# EAGLE design ice_tube_clock (EAGLE 7.3.0)
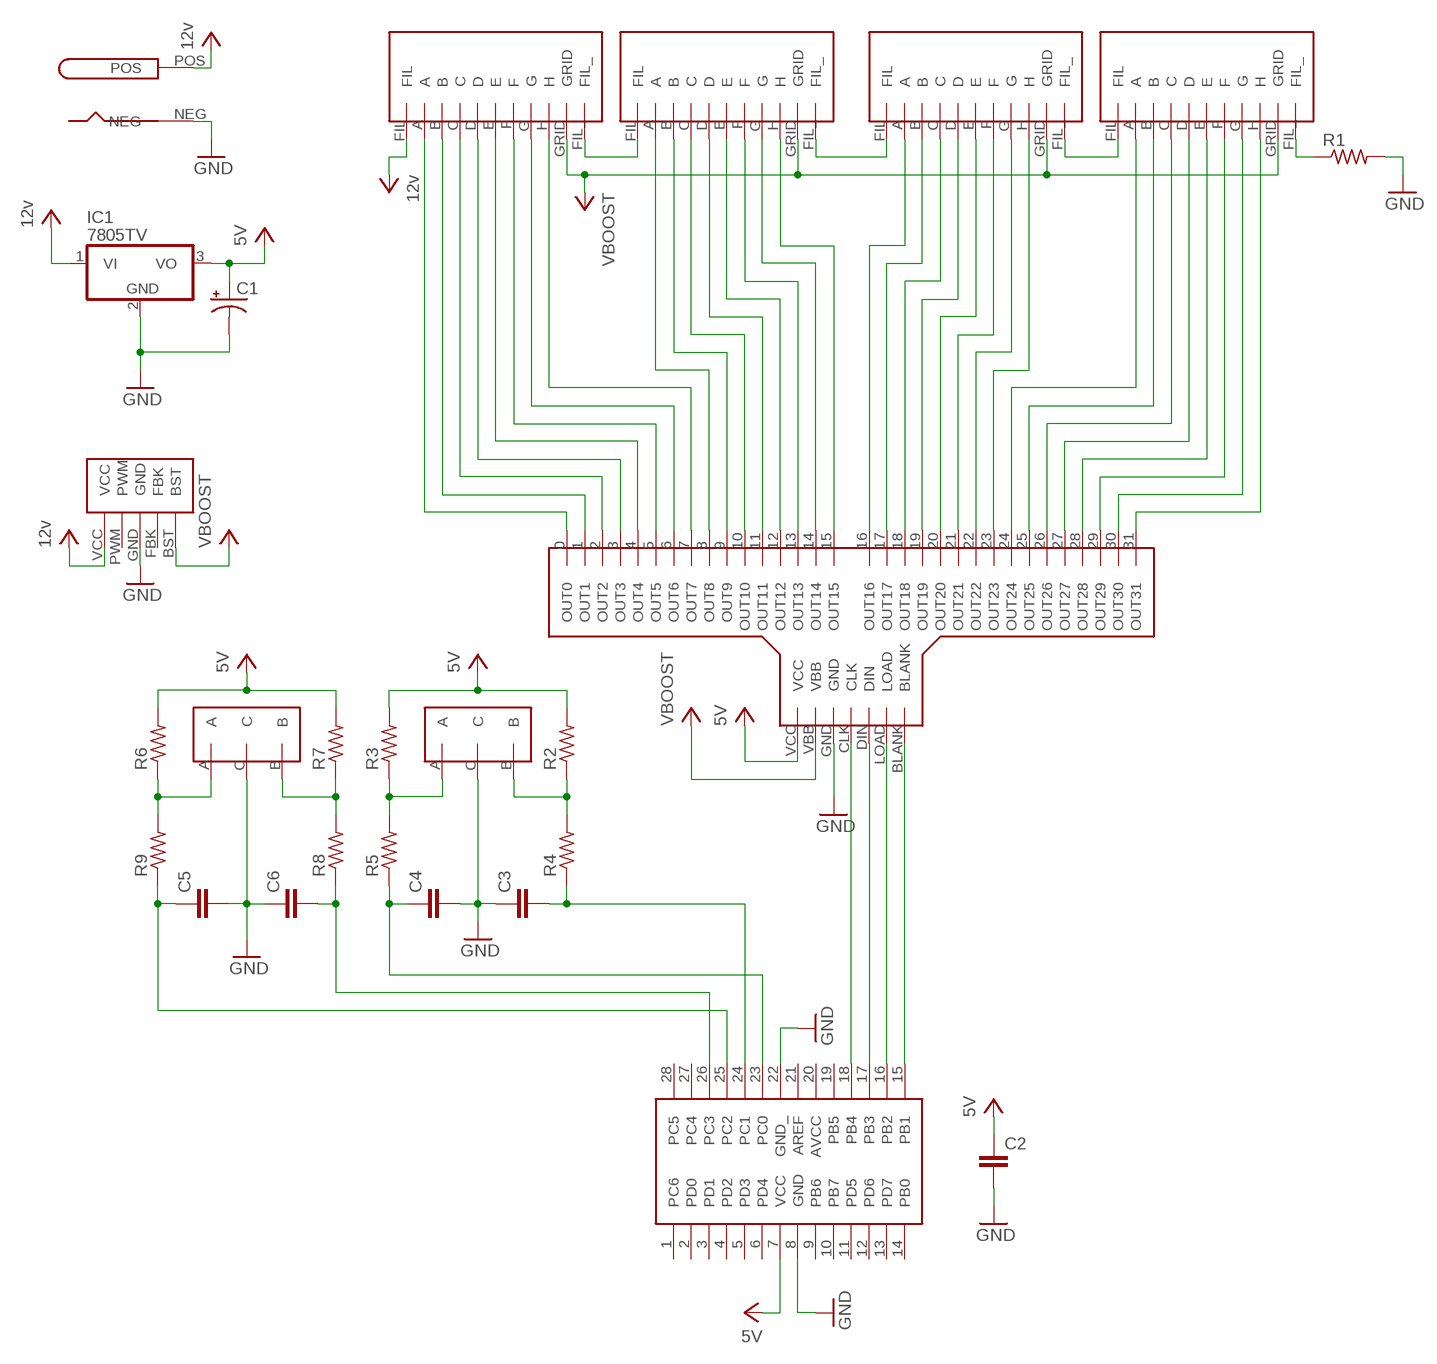
[diagram p0: schematic, sheet 1]

## Parts
C1  CAP_POLPTH1  [CPOL-RADIAL-100UF-25V]
C2  0.1UF-50V-20%(PTH)KIT-EZ  [CAP-PTH-SMALL-KIT]
C3  0.1UF-50V-20%(PTH)KIT-EZ  [CAP-PTH-SMALL-KIT]
C4  0.1UF-50V-20%(PTH)KIT-EZ  [CAP-PTH-SMALL-KIT]
C5  0.1UF-50V-20%(PTH)KIT-EZ  [CAP-PTH-SMALL-KIT]
C6  0.1UF-50V-20%(PTH)KIT-EZ  [CAP-PTH-SMALL-KIT]
IC1  7805TV  [TO220V]
R1  R-US_0204/7  [0204/7]
R2  R-US_0204/7  [0204/7]
R3  R-US_0204/7  [0204/7]
R4  R-US_0204/7  [0204/7]
R5  R-US_0204/7  [0204/7]
R6  R-US_0204/7  [0204/7]
R7  R-US_0204/7  [0204/7]
R8  R-US_0204/7  [0204/7]
R9  R-US_0204/7  [0204/7]
U$1  ATMEGA168-DIP28  [DIP28]
U$2  IV11-BOOST-SUPPLY  [IV11-BOOST-SUPPLY]
U$3  IV-11-CARRIER  [IV-11-CARRIER]
U$4  IV-11-CARRIER  [IV-11-CARRIER]
U$5  IV-11-CARRIER  [IV-11-CARRIER]
U$6  IV-11-CARRIER  [IV-11-CARRIER]
U$7  PJ-037A  [PJ-037A]
U$8  VFD-DRIVER-CARRIER  [VFD-DRIVER-CARRIER]
U$9  PEL12S  [PEL12S]
U$10  PEL12S  [PEL12S]

## Nets
+5V: C1.1(+) C2.1 IC1.3(VO) R2.2 R3.2 R6.2 R7.2 U$1.7(VCC) U$8.VCC ; supply symbol labelled 5V
+12V: IC1.1(VI) U$2.VCC U$3.FIL U$7.POS ; supply symbol labelled 12v
ET: C4.1 R5.1 U$1.23(PC0)
GND: C1.2(-) C2.2 C3.1 C4.2 C5.2 C6.1 IC1.2(GND) R1.2 U$1.8(GND) U$1.22(GND_) U$2.GND U$7.NEG U$8.GND U$9.C U$10.C
N$1: U$3.FIL_ U$4.FIL
N$2: U$4.FIL_ U$5.FIL
N$3: U$5.FIL_ U$6.FIL
N$4: U$3.A U$8.0(OUT0)
N$5: U$3.B U$8.1(OUT1)
N$6: U$3.C U$8.2(OUT2)
N$7: U$3.D U$8.3(OUT3)
N$8: U$3.E U$8.4(OUT4)
N$9: U$3.F U$8.5(OUT5)
N$10: U$3.G U$8.6(OUT6)
N$11: U$3.H U$8.7(OUT7)
N$13: U$4.A U$8.8(OUT8)
N$14: U$4.B U$8.9(OUT9)
N$15: U$4.C U$8.10(OUT10)
N$16: U$4.D U$8.11(OUT11)
N$17: U$4.E U$8.12(OUT12)
N$18: U$4.F U$8.13(OUT13)
N$19: U$4.G U$8.14(OUT14)
N$20: U$4.H U$8.15(OUT15)
N$21: U$6.H U$8.31(OUT31)
N$22: U$6.G U$8.30(OUT30)
N$23: U$6.F U$8.29(OUT29)
N$24: U$6.E U$8.28(OUT28)
N$25: U$6.D U$8.27(OUT27)
N$26: U$6.C U$8.26(OUT26)
N$27: U$6.B U$8.25(OUT25)
N$28: U$6.A U$8.24(OUT24)
N$29: U$5.H U$8.23(OUT23)
N$30: U$5.G U$8.22(OUT22)
N$31: U$5.F U$8.21(OUT21)
N$32: U$5.E U$8.20(OUT20)
N$33: U$5.D U$8.19(OUT19)
N$34: U$5.C U$8.18(OUT18)
N$35: U$5.B U$8.17(OUT17)
N$36: U$5.A U$8.16(OUT16)
N$37: R1.1 U$6.FIL_
N$38: U$1.15(PB1) U$8.BLANK
N$39: U$1.16(PB2) U$8.LOAD
N$40: U$1.17(PB3) U$8.DIN
N$41: U$1.18(PB4) U$8.CLK
N$43: C3.2 R4.1 U$1.24(PC1)
N$44: R3.1 R5.2 U$10.A
N$45: R6.1 R9.2 U$9.A
N$46: R7.1 R8.2 U$9.B
N$47: R2.1 R4.2 U$10.B
N$48: C5.1 R9.1 U$1.25(PC2)
N$49: C6.2 R8.1 U$1.26(PC3)
VBOOST: U$2.BST U$3.GRID U$4.GRID U$5.GRID U$6.GRID U$8.VBB
Unconnected: U$1.1(PC6) U$1.2(PD0) U$1.3(PD1) U$1.4(PD2) U$1.5(PD3) U$1.6(PD4) U$1.9(PB6) U$1.10(PB7) U$1.11(PD5) U$1.12(PD6) U$1.13(PD7) U$1.14(PB0) U$1.19(PB5) U$1.20(AVCC) U$1.21(AREF) U$1.27(PC4) U$1.28(PC5) U$2.FBK U$2.PWM

## Library data of the parts
C1 = SparkFun-Passives:CAP_POL: Capacitor Polarized These are standard SMD and PTH capacitors. Normally 10uF, 47uF, and 100uF in electrolytic and tantalum varieties. Always verify the external diameter of the through hole cap, it varies with capacity, voltage, and manufacturer. The EIA devices should be standard.
C2-C6 = SparkFun-Capacitors:0.1UF-50V-20%(PTH): CAP-08370; PROD_ID: CAP-08370
IC1 = linear:78*: Positive VOLTAGE REGULATOR Source: http://cache.national.com/ds/LM/LM78L05.pdf http://www.fairchildsemi.com/ds/LM/LM7805.pdf
R1-R9 = resistor:R-US_: RESISTOR, American symbol
U$1 = boztalay:ATMEGA168-DIP28
U$2 = boztalay:IV11-BOOST-SUPPLY
U$3-U$6 = boztalay:IV-11-CARRIER
U$7 = boztalay:PJ-037A
U$8 = boztalay:VFD-DRIVER-CARRIER
U$9 U$10 = boztalay:PEL12S

## Board
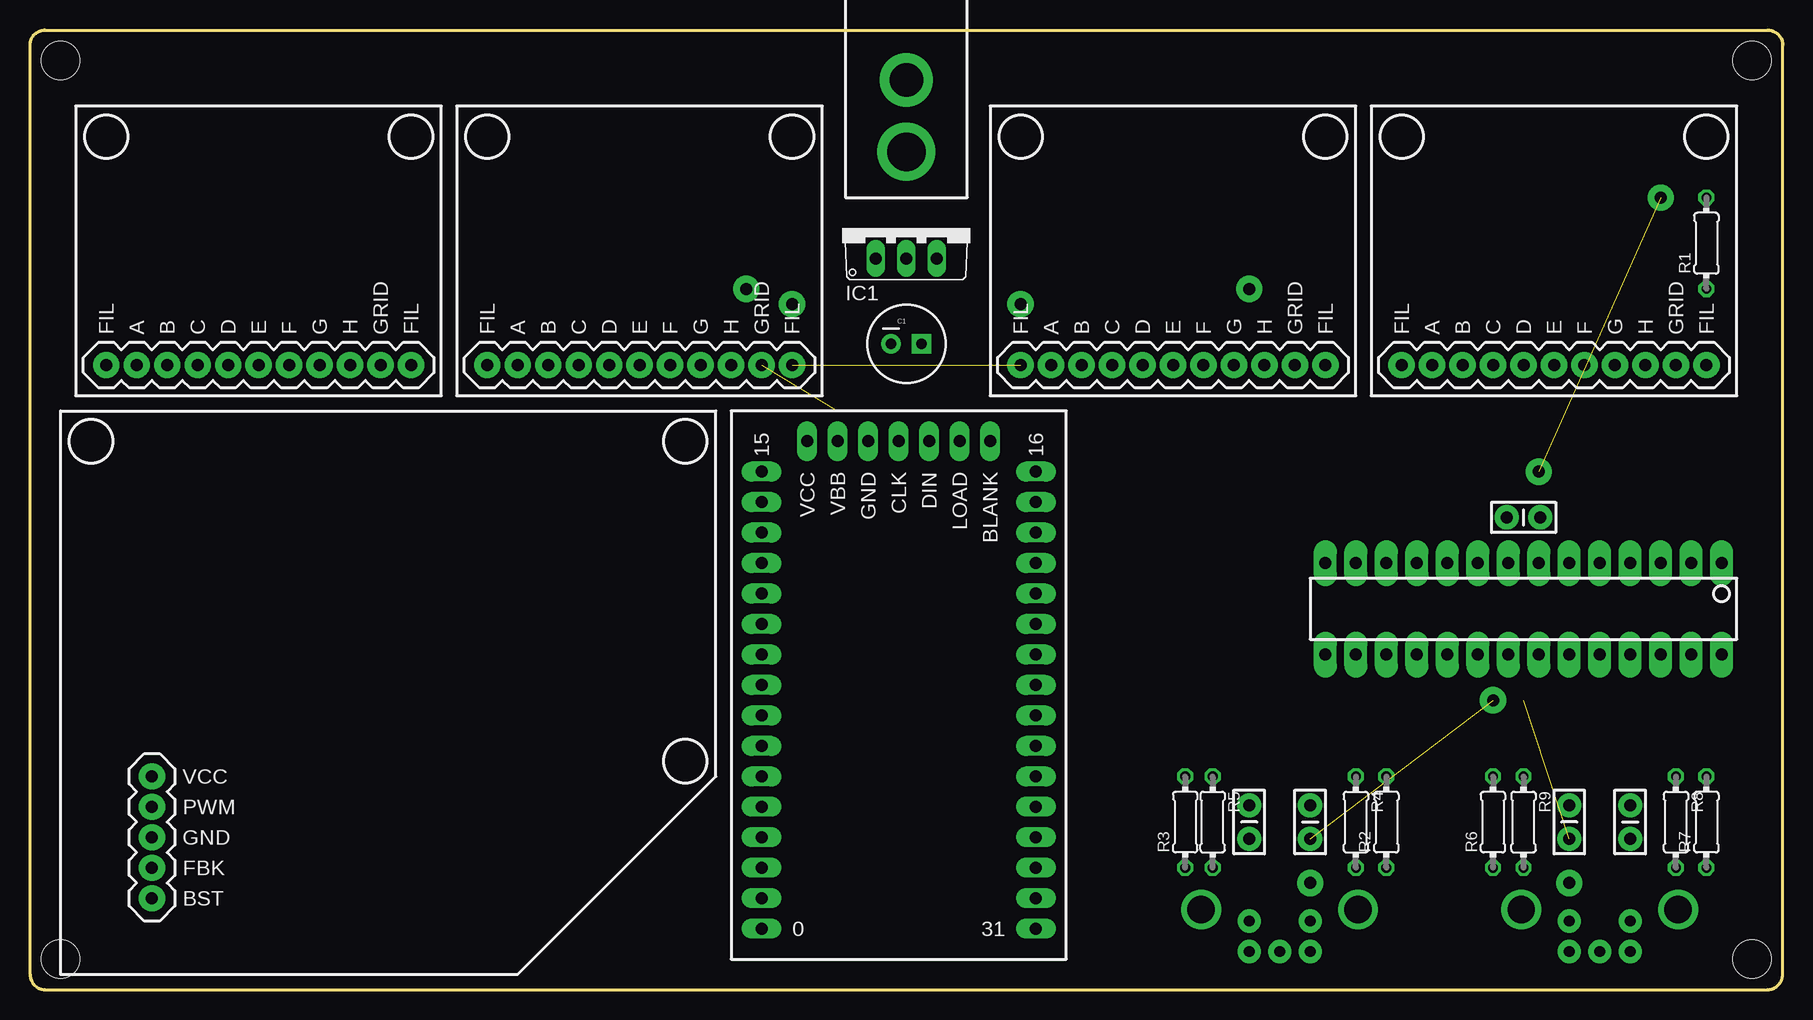
[diagram p1: board, top side]
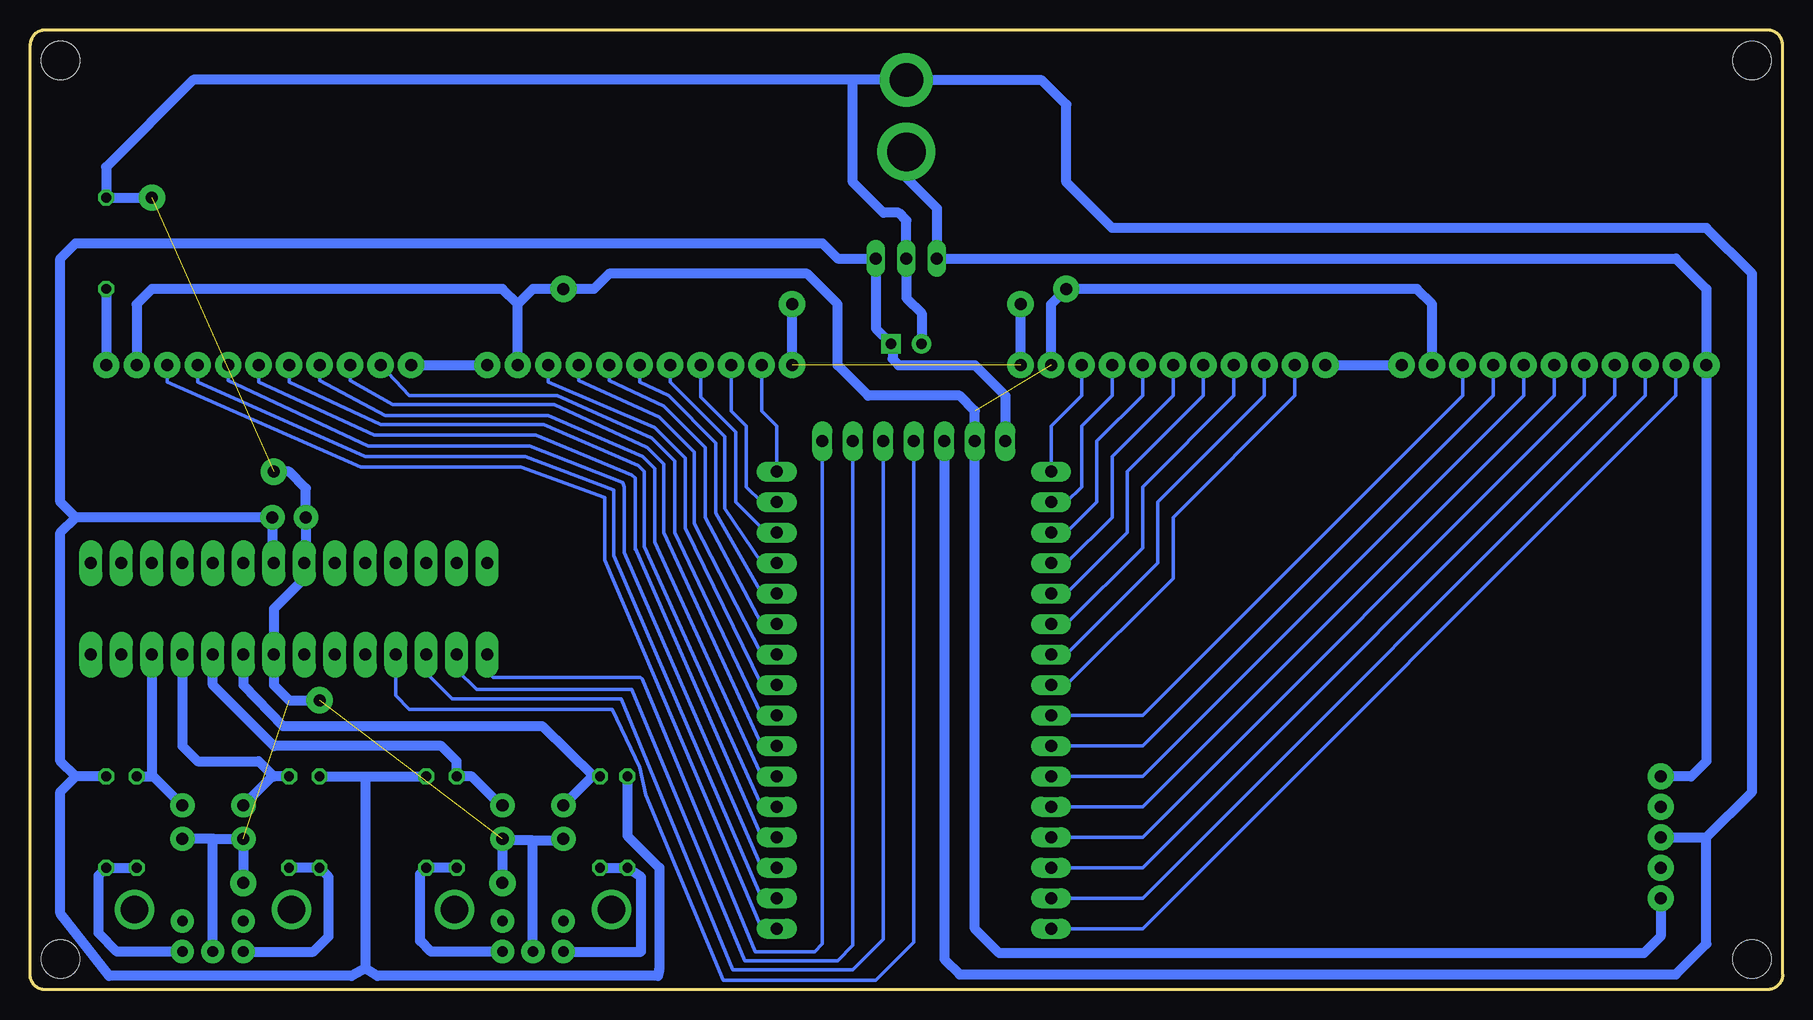
[diagram p2: board, bottom side, seen from below]

Size 146.05 x 80.01 mm. Coordinates in mm from the lower left corner, seen from the top.
Outline: 0,1.27 0,78.74 arc-90 1.27,80.01 144.78,80.01 arc-90 146.05,78.74 146.05,1.27 arc-90 144.78,0 1.27,0 arc-90 0,1.27
Copper layers (1*16): Top 0.035mm / dielectric 1.5mm / Bottom 0.035mm
Design rules "default *": minimum track width 12mil, minimum drill 24mil, track to track 14mil, track to pad 14mil, pad to pad 14mil, via to via 14mil, smd to smd 8mil, copper to edge 40mil, drill to drill 8mil, minimum pad ring 10mil, minimum via ring 8mil, stop-mask expansion 4mil, vias tented up to drill 0mil, thermal gap 10mil
Holes 3.2 mm at 2.54,77.47 143.51,77.47 143.51,2.54 2.54,2.54

### Footprints (pad centres in the part's own frame; a part is rotated, then mirrored left to right if it is on the bottom)
CPOL-RADIAL-100UF-25V = drill 0.9 pad 1.651 square: 1 1.27,0 | drill 0.9 pad 1.651: 2 -1.27,0
CAP-PTH-SMALL-KIT = drill 1.016 pad 2.032: 1 -1.397,0; 2 1.397,0
TO220V = drill 1.016 long: 1 -2.54,-2.54; 2 0,-2.54; 3 2.54,-2.54
0204/7 = drill 0.813 octagon: 1 -3.81,0; 2 3.81,0
DIP28 = drill 1 pad 1.93 long: 1 16.51,3.81; 2 13.97,3.81; 3 11.43,3.81; 4 8.89,3.81; 5 6.35,3.81; 6 3.81,3.81; 7 1.27,3.81; 8 -1.27,3.81; 9 -3.81,3.81; 10 -6.35,3.81; 11 -8.89,3.81; 12 -11.43,3.81; 13 -13.97,3.81; 14 -16.51,3.81; 15 -16.51,-3.81; 16 -13.97,-3.81; 17 -11.43,-3.81; 18 -8.89,-3.81; 19 -6.35,-3.81; 20 -3.81,-3.81; 21 -1.27,-3.81; 22 1.27,-3.81; 23 3.81,-3.81; 24 6.35,-3.81; 25 8.89,-3.81; 26 11.43,-3.81; 27 13.97,-3.81; 28 16.51,-3.81
IV11-BOOST-SUPPLY = drill 1 pad 2.184: BST 5.08,0; FBK 2.54,0; GND 0,0; PWM -2.54,0; VCC -5.08,0
IV-11-CARRIER = drill 1 pad 2.184: A -10.16,0; B -7.62,0; C -5.08,0; D -2.54,0; E 0,0; F 2.54,0; FIL -12.7,0; FIL_ 12.7,0; G 5.08,0; GRID 10.16,0; H 7.62,0
PJ-037A = drill 2.8 pad 4.445: NEG -5.994,0 | drill 3.2 pad 4.826: POS 0,0
VFD-DRIVER-CARRIER = drill 1 pad 1.676 long: 0 -11.43,-20.32; 1 -11.43,-17.78; 2 -11.43,-15.24; 3 -11.43,-12.7; 4 -11.43,-10.16; 5 -11.43,-7.62; 6 -11.43,-5.08; 7 -11.43,-2.54; 8 -11.43,0; 9 -11.43,2.54; 10 -11.43,5.08; 11 -11.43,7.62; 12 -11.43,10.16; 13 -11.43,12.7; 14 -11.43,15.24; 15 -11.43,17.78; 16 11.43,17.78; 17 11.43,15.24; 18 11.43,12.7; 19 11.43,10.16; 20 11.43,7.62; 21 11.43,5.08; 22 11.43,2.54; 23 11.43,0; 24 11.43,-2.54; 25 11.43,-5.08; 26 11.43,-7.62; 27 11.43,-10.16; 28 11.43,-12.7; 29 11.43,-15.24; 30 11.43,-17.78; 31 11.43,-20.32; BLANK 7.62,20.32; CLK 0,20.32; DIN 2.54,20.32; GND -2.54,20.32; LOAD 5.08,20.32; VBB -5.08,20.32; VCC -7.62,20.32
PEL12S = drill 0.9 pad 1.93: A -2.54,0; B 2.54,0; C 0,0; P$4 2.54,2.54; P$5 -2.54,2.54 | drill 2.286 pad 2.54: P$1 6.54,3.505; P$2 -6.54,3.505

### Placement (x,y rotation side)
C1  73.03,53.85 0 top
C2  124.46,39.37 180 top
C3  106.68,13.97 90 top
C4  101.6,13.97 270 top
C5  128.27,13.97 270 top
C6  133.35,13.97 90 top
IC1  73.03,63.5 0 top
R1  139.7,62.23 90 top
R2  113.03,13.97 90 top
R3  96.27,13.97 90 top
R4  110.49,13.97 270 top
R5  98.55,13.97 270 top
R6  121.92,13.97 90 top
R7  139.7,13.97 90 top
R8  137.16,13.97 270 top
R9  124.46,13.97 270 top
U$1  124.46,31.75 0 top
U$2  10.16,12.7 270 top
U$3  19.05,52.07 0 top
U$4  50.8,52.07 0 top
U$5  95.25,52.07 0 top
U$6  127,52.07 0 top
U$7  73.03,69.85 270 top
U$8  72.39,25.4 0 top
U$9  130.81,3.17 0 top
U$10  104.14,3.17 0 top

### Tracks (layer width: path | path; a pad name or v marks a point on that pad's centre or on a via)
+5V
  Bottom 0.813: 142.24,39.37 C2.1 125.86,35.69 U$1.7 | 142.24,39.37 143.51,40.64 143.51,60.96 142.24,62.23 80.01,62.23 78.74,60.96 IC1.3 75.56,55.12 C1.1 74.17,53.85 74.17,52.58 73.66,52.07 67.31,52.07 64.77,49.53 U$8.VCC | R7.2 142.24,17.78 | 142.24,17.78 143.51,19.05 143.51,38.1 142.24,39.37 | R6.2 118.11,17.78 | 118.11,17.78 118.11,1.78 | 118.11,1.78 119.25,1.14 139.45,1.14 143.51,6.35 143.51,16.51 142.24,17.78 | 118.11,17.78 R2.2 | 93.6,1.78 93.62,1.66 | 93.62,1.66 93.73,1.14 117.09,1.14 118.11,1.78 | R3.2 96.27,12.83 93.6,10.16 93.62,1.66
+12V
  Bottom 0.813: U$7.POS 73.03,67.69 70.48,65.15 IC1.1 8.89,60.96 6.35,58.42 U$3.FIL 6.35,19.05 7.62,17.78 U$2.VCC
ET
  Bottom 0.813: R5.1 99.06,17.78 | 99.06,17.78 99.19,17.78 C4.1 | U$1.23 128.27,25.4 124.97,21.97 103.38,21.97 99.06,17.78
GND  (3 unrouted)
  Bottom 0.813: C1.2 71.75,56.39 73.03,57.66 IC1.2 73.03,64.14 73.66,64.77 74.93,64.77 77.47,67.31 77.47,75.84 | 77.47,75.84 U$7.NEG 73,75.82 61.72,75.82 59.69,73.79 59.69,67.31 55.88,63.5 6.35,63.5 2.54,59.69 2.54,16.51 6.35,12.7 | 77.47,75.84 132.44,75.84 139.7,68.58 R1.2 135.89,66.04 | U$2.GND 6.35,12.7 | U$8.GND 69.85,2.54 68.58,1.27 8.89,1.27 6.35,3.81 6.35,12.7 | U$9.C 130.81,12.57 | 130.81,12.57 C6.1 | 130.81,12.57 C5.2 128.27,8.89 | U$10.C 104.14,12.45 | 104.14,12.45 101.73,12.45 C4.2 | 104.14,12.45 106.55,12.45 C3.1 106.68,8.89 | 125.73,43.18 124.46,43.18 123.06,41.78 C2.2 123.06,35.69 U$1.8 123.19,34.29 125.73,31.75 U$1.22 125.73,25.4 124.46,24.13 121.92,24.13
N$1
  Bottom 0.813: U$4.FIL U$3.FIL_
N$2  (1 unrouted)
  Bottom 0.813: U$4.FIL_ 63.5,57.15 | U$5.FIL 82.55,57.15
N$3
  Bottom 0.813: U$6.FIL U$5.FIL_
N$4
  Bottom 0.305: U$8.0 53.34,5.08 8.89,49.53 U$3.A
N$5
  Bottom 0.305: U$3.B 11.43,49.53 53.34,7.62 U$8.1
N$6
  Bottom 0.305: U$8.2 53.34,10.16 13.97,49.53 U$3.C
N$7
  Bottom 0.305: U$3.D 16.51,49.53 53.34,12.7 U$8.3
N$8
  Bottom 0.305: U$8.4 53.34,15.24 19.05,49.53 U$3.E
N$9
  Bottom 0.305: U$3.F 21.59,49.53 53.34,17.78 U$8.5
N$10
  Bottom 0.305: U$8.6 53.34,20.32 24.13,49.53 U$3.G
N$11
  Bottom 0.305: U$3.H 26.67,49.53 53.34,22.86 U$8.7
N$13
  Bottom 0.305: U$4.A 40.64,49.53 50.8,39.37 50.8,34.29 59.69,25.4 U$8.8
N$14
  Bottom 0.305: U$4.B 43.18,49.53 52.07,40.64 52.07,35.56 59.69,27.94 U$8.9
N$15
  Bottom 0.305: U$8.10 59.69,30.48 53.34,36.83 53.34,41.91 45.72,49.53 U$4.C
N$16
  Bottom 0.305: U$4.D 48.26,49.53 54.61,43.18 54.61,38.1 59.69,33.02 U$8.11
N$17
  Bottom 0.305: U$8.12 59.69,35.56 55.88,39.37 55.88,44.45 50.8,49.53 U$4.E
N$18
  Bottom 0.305: U$4.F 53.34,49.53 57.15,45.72 57.15,40.64 59.69,38.1 U$8.13
N$19
  Bottom 0.305: U$8.14 59.69,40.64 58.42,41.91 58.42,46.99 55.88,49.53 U$4.G
N$20
  Bottom 0.305: U$8.15 60.96,46.99 58.42,49.53 U$4.H
N$21
  Bottom 0.305: U$8.31 85.09,5.08 98.17,35.81 98.17,41.02 105.16,43.56 118.49,43.56 134.62,50.67 U$6.H
N$22
  Bottom 0.305: U$8.30 85.09,7.62 97.41,36.2 97.41,41.66 104.78,44.45 118.11,44.45 132.08,50.67 U$6.G
N$23
  Bottom 0.305: U$8.29 85.09,10.16 96.52,36.45 96.52,41.91 96.65,42.29 104.39,45.34 117.86,45.34 129.54,50.8 U$6.F
N$24
  Bottom 0.305: U$8.28 85.09,12.7 95.63,36.83 | 95.63,36.7 95.63,36.83 | 95.63,36.83 95.63,42.67 95.89,42.93 103.89,46.23 117.35,46.23 127,50.67 U$6.E
N$25
  Bottom 0.305: U$8.27 85.09,15.24 94.87,36.96 94.87,43.18 95.38,43.69 103.25,47.12 116.84,47.12 124.46,50.67 U$6.D
N$26
  Bottom 0.305: U$8.26 85.09,17.78 93.98,37.34 93.98,43.43 95,44.45 102.87,47.88 116.46,47.88 121.92,50.8 U$6.C
N$27
  Bottom 0.305: U$8.25 85.09,20.32 93.22,38.1 93.22,43.81 94.61,45.21 102.36,48.77 115.82,48.77 119.38,50.8 U$6.B
N$28
  Bottom 0.305: U$8.24 85.09,22.86 92.33,38.1 92.33,44.07 94.23,45.97 102.11,49.53 114.43,49.53 U$6.A
N$29
  Bottom 0.305: U$8.23 85.09,25.4 91.44,38.48 91.44,44.32 93.98,46.86 102.87,50.67 U$5.H
N$30
  Bottom 0.305: U$8.22 85.09,27.94 90.68,38.86 90.68,44.83 93.6,47.75 100.33,50.8 U$5.G
N$31
  Bottom 0.305: U$8.21 85.09,30.48 89.79,39.37 89.79,45.21 93.22,48.64 97.79,50.8 U$5.F
N$32
  Bottom 0.305: U$8.20 85.09,33.02 88.9,39.75 88.9,45.59 92.84,49.53 95.25,50.67 U$5.E
N$33
  Bottom 0.305: U$8.19 85.09,35.56 88.14,40.13 88.14,46.1 92.71,50.67 U$5.D
N$34
  Bottom 0.305: U$8.18 84.71,38.1 87.25,40.64 87.25,46.48 90.17,49.4 U$5.C
N$35
  Bottom 0.305: U$8.17 85.09,40.64 86.36,41.91 86.36,46.99 87.63,48.26 U$5.B
N$36
  Bottom 0.305: U$8.16 83.82,46.99 85.09,48.26 U$5.A
N$37
  Bottom 0.813: R1.1 U$6.FIL_
N$38
  Bottom 0.305: U$8.BLANK 80.01,3.81 80.64,3.17 85.6,3.17 95.04,25.89 95.18,26.04 107.44,26.04 107.95,26.54 U$1.15
N$39
  Bottom 0.305: U$8.LOAD 77.47,3.68 78.74,2.41 86.49,2.41 95.89,25.02 108.84,25.02 110.49,26.67 U$1.16
N$40
  Bottom 0.305: U$8.DIN 74.93,4.19 77.47,1.65 87.5,1.65 96.77,24.26 110.87,24.26 113.03,26.42 U$1.17
N$41
  Bottom 0.305: U$8.CLK 72.39,3.94 75.56,0.76 88.27,0.76 94.74,16.26 95.25,18.54 97.54,23.37 114.43,23.37 115.57,24.51 U$1.18
N$42  (via drill 1 pad 2.18)
  other vias: 82.55,57.15
N$43
  Bottom 0.813: C3.2 106.81,15.37 109.22,17.78 R4.1 110.49,19.05 111.76,20.32 125.73,20.32 130.81,25.4 U$1.24
N$44
  Bottom 0.813: R5.2 R3.1 95.12,9.4 95.12,3.17 U$10.A
N$45
  Bottom 0.813: U$9.A 122.43,3.17 121.16,4.45 121.16,9.4 R6.1 R9.2
N$46
  Bottom 0.813: U$9.B 138.81,3.17 140.34,4.7 140.34,9.53 R7.1 R8.2
N$47
  Bottom 0.813: R4.2 R2.1 113.54,9.65 113.54,4.06 112.65,3.17 U$10.B
N$48
  Bottom 0.813: R9.1 125.73,17.78 | 125.73,17.78 125.86,17.78 C5.1 | U$1.25 133.35,20.32 132.08,19.05 127,19.05 125.73,17.78
N$49
  Bottom 0.813: R8.1 135.76,17.78 | 135.76,17.78 C6.2 | U$1.26 135.89,17.91 135.76,17.78
N$50  (via drill 1 pad 2.18)
  other vias: 101.6,58.42
N$51  (via drill 1 pad 2.18)
  other vias: 63.5,57.15
N$52  (via drill 1 pad 2.18)
  other vias: 59.69,58.42
N$53  (via drill 1 pad 2.18)
  other vias: 121.92,24.13
N$54  (via drill 1 pad 2.18)
  other vias: 125.73,43.18
N$55  (via drill 1 pad 2.18)
  other vias: 135.89,66.04
N$56  (via drill 1 pad 2.18)
  other vias: 106.68,8.89
N$57  (via drill 1 pad 2.18)
  other vias: 128.27,8.89
VBOOST  (1 unrouted)
  Bottom 0.813: U$2.BST 10.16,4.45 11.56,3.05 65.28,3.05 67.31,5.08 U$8.VBB 67.31,48.26 68.58,49.53 76.2,49.53 78.74,52.07 78.74,57.15 81.28,59.69 97.79,59.69 99.06,58.42 104.14,58.42 105.41,57.15 | U$4.GRID 60.96,57.15 59.69,58.42 30.48,58.42 29.21,57.15 U$3.GRID | U$5.GRID 105.41,57.15 | 105.41,57.15 106.68,58.42 135.89,58.42 137.16,57.15 U$6.GRID